# EAGLE schematic LPC82X_TSSOP_breadboard_mini (EAGLE 7.1.0)
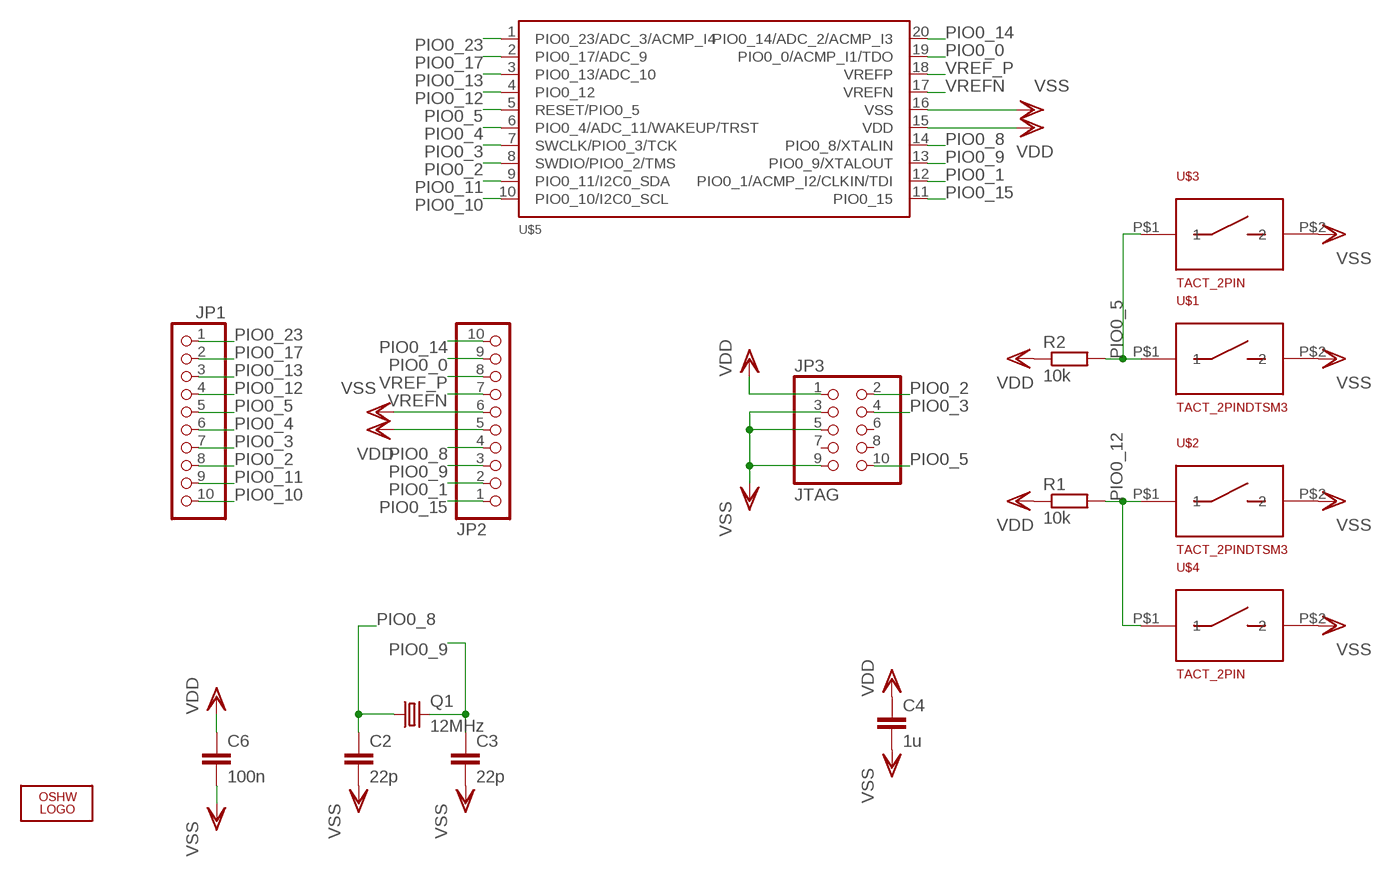
[diagram p0: schematic, sheet 1]

## Parts
C2  22p  C-EUC0603K  [C0603K]
C3  22p  C-EUC0603K  [C0603K]
C4  1u  C-EUC0805K  [C0805K]
C6  100n  C-EUC0603K  [C0603K]
JP1  PINHD-1X10NORM_OCT  [1X10_NORMAL_OCT]
JP2  PINHD-1X10NORM_OCT  [1X10_NORMAL_OCT]
JP3  JTAG  PINHD-2X5SMD_1.27_SMD  [2X05_1.27_SMD]
LOGO2  OSHW_LOGO_FILLX0150-NT  [OSHW_FILLX150_NOTEXT]
Q1  12MHz  CRYSTALSMD_5.0X3.2  [CRYSTAL_5.0X3.2]
R1  10k  R-EU_R0603  [R0603]
R2  10k  R-EU_R0603  [R0603]
U$1  TACT_2PINDTSM3  [DTSM3]
U$2  TACT_2PINDTSM3  [DTSM3]
U$3  TACT_2PIN  [TD-85XU]
U$4  TACT_2PIN  [TD-85XU]
U$5  LPC82XM101JDH20  [TSSOP20]

## Nets
PIO0_0: JP2.9 U$5.19(PIO0_0/ACMP_I1/TDO)
PIO0_1: JP2.2 U$5.12(PIO0_1/ACMP_I2/CLKIN/TDI)
PIO0_2: JP1.8 JP3.2 U$5.8(SWDIO/PIO0_2/TMS)
PIO0_3: JP1.7 JP3.4 U$5.7(SWCLK/PIO0_3/TCK)
PIO0_4: JP1.6 U$5.6(PIO0_4/ADC_11/WAKEUP/TRST)
PIO0_5: JP1.5 JP3.10 R2.2 U$1.P$1 U$3.P$1 U$5.5(RESET/PIO0_5)
PIO0_8: C2.1 JP2.4 Q1.1 U$5.14(PIO0_8/XTALIN)
PIO0_9: C3.1 JP2.3 Q1.2 U$5.13(PIO0_9/XTALOUT)
PIO0_10: JP1.10 U$5.10(PIO0_10/I2C0_SCL)
PIO0_11: JP1.9 U$5.9(PIO0_11/I2C0_SDA)
PIO0_12: JP1.4 R1.2 U$2.P$1 U$4.P$1 U$5.4(PIO0_12)
PIO0_13: JP1.3 U$5.3(PIO0_13/ADC_10)
PIO0_14: JP2.10 U$5.20(PIO0_14/ADC_2/ACMP_I3)
PIO0_15: JP2.1 U$5.11(PIO0_15)
PIO0_17: JP1.2 U$5.2(PIO0_17/ADC_9)
PIO0_23: JP1.1 U$5.1(PIO0_23/ADC_3/ACMP_I4)
VDD: C4.1 C6.1 JP2.5 JP3.1 R1.1 R2.1 U$5.15(VDD)
VREF_P: JP2.8 U$5.18(VREFP)
VREFN: JP2.7 U$5.17(VREFN)
VSS: C2.2 C3.2 C4.2 C6.2 JP2.6 JP3.3 JP3.5 JP3.9 U$1.P$2 U$2.P$2 U$3.P$2 U$4.P$2 U$5.16(VSS)
Unconnected: JP3.6 JP3.7 JP3.8

## Library data of the parts
C2 C3 C6 = SquantorRCL:C-EU: CAPACITOR, European symbol
C4 = bart_rcl:C-EU: CAPACITOR, European symbol
JP1 JP2 = SquantorConnectors:PINHD-1X10: PIN HEADER
JP3 = SquantorConnectors:PINHD-2X5: PIN HEADER
LOGO2 = ohw-logo:OSHW_LOGO_FILL
Q1 = bart_crystals:CRYSTAL: CRYSTAL
R1 R2 = bart_rcl:R-EU_: RESISTOR, European symbol
U$1-U$4 = SquantorButtons:TACT_2PIN
U$5 = LPC800:LPC82XM101JDH20